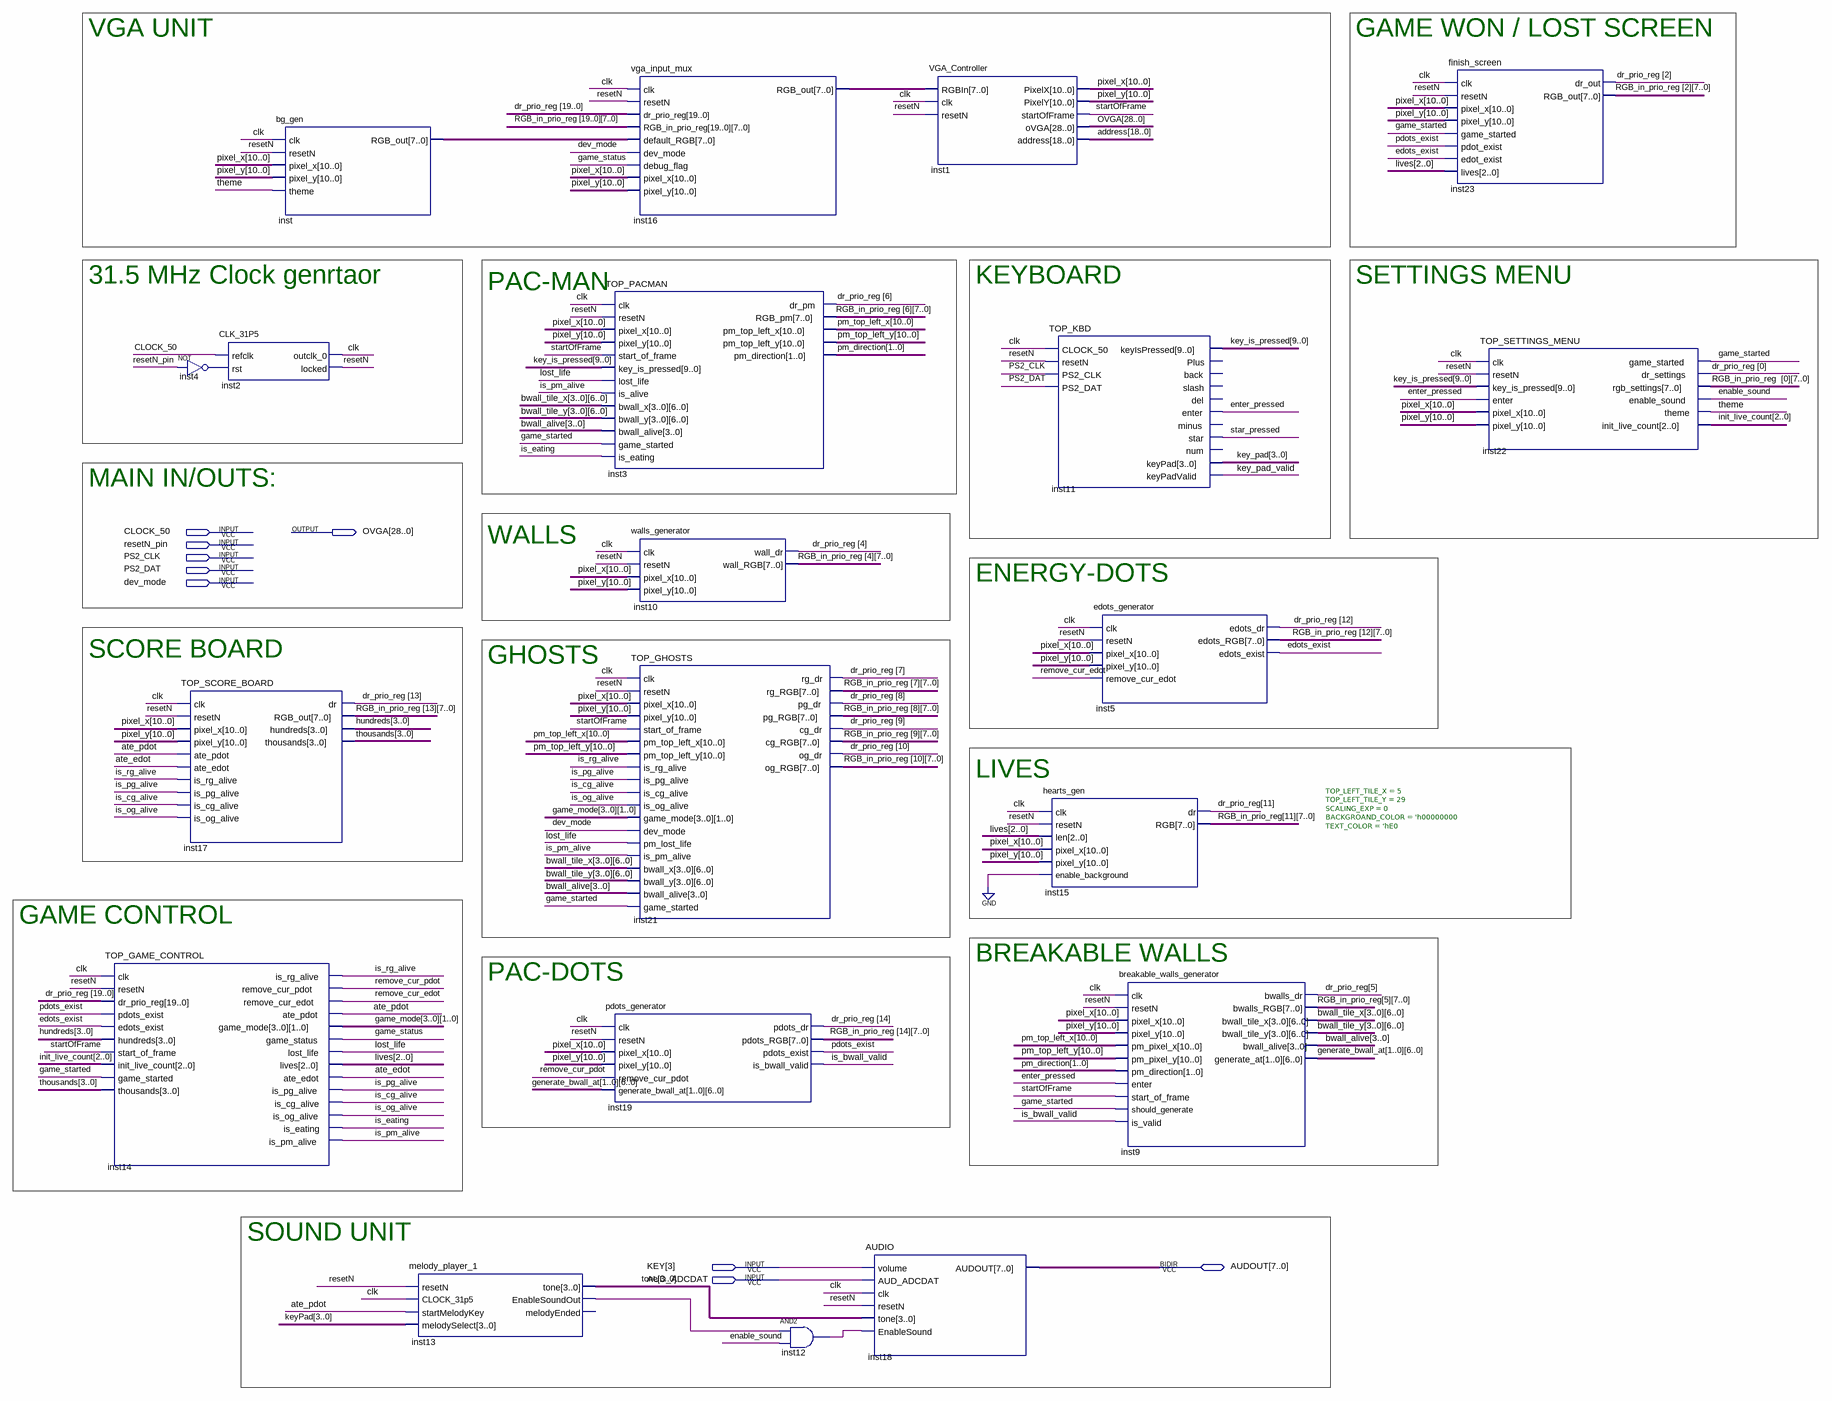
[diagram p0: schematic sheet]
// Quartus schematic TOP_GAME.bdf as structural Verilog: 20 symbols, 9 pins
module TOP_GAME (
  input  CLOCK_50,
  input  resetN_pin,
  input  PS2_CLK,
  input  PS2_DAT,
  input  dev_mode,
  input  [3:3] KEY,
  input  AUD_ADCDAT,
  inout  [7:0] AUDOUT,
  output [28:0] OVGA
);

  wire ate_edot, ate_pdot, clk, edots_exist, enable_sound, enter_pressed, game_started, game_status,
       inst4_out, inst12_out, inst13_enablesoundout, is_bwall_valid, is_cg_alive, is_eating, is_og_alive,
       is_pg_alive, is_pm_alive, is_rg_alive, key_pad_valid, lost_life, pdots_exist, remove_cur_edot,
       remove_cur_pdot, resetN, star_pressed, startOfFrame, theme;
  wire [1:0] game_mode_0, game_mode_1, game_mode_2, game_mode_3, pm_direction;
  wire [2:0] init_live_count, lives;
  wire [3:0] bwall_alive, hundreds, key_pad, keyPad, thousands, tone;
  wire [6:0] bwall_tile_x_0, bwall_tile_x_1, bwall_tile_x_2, bwall_tile_x_3, bwall_tile_y_0, bwall_tile_y_1,
       bwall_tile_y_2, bwall_tile_y_3, generate_bwall_at_0, generate_bwall_at_1;
  wire [7:0] inst16_rgb_out, inst_rgb_out, RGB_in_prio_reg_0, RGB_in_prio_reg_1, RGB_in_prio_reg_2,
       RGB_in_prio_reg_3, RGB_in_prio_reg_4, RGB_in_prio_reg_5, RGB_in_prio_reg_6, RGB_in_prio_reg_7,
       RGB_in_prio_reg_8, RGB_in_prio_reg_9, RGB_in_prio_reg_10, RGB_in_prio_reg_11, RGB_in_prio_reg_12,
       RGB_in_prio_reg_13, RGB_in_prio_reg_14, RGB_in_prio_reg_15, RGB_in_prio_reg_16, RGB_in_prio_reg_17,
       RGB_in_prio_reg_18, RGB_in_prio_reg_19;
  wire [9:0] key_is_pressed;
  wire [10:0] pixel_x, pixel_y, pm_top_left_x, pm_top_left_y;
  wire [18:0] address;
  wire [19:0] dr_prio_reg;

  TOP_GAME_CONTROL inst14 (
    .clk(clk), .resetN(resetN), .dr_prio_reg(dr_prio_reg), .pdots_exist(pdots_exist),
    .edots_exist(edots_exist), .hundreds(hundreds), .start_of_frame(startOfFrame),
    .init_live_count(init_live_count), .game_started(game_started), .thousands(thousands),
    .is_rg_alive(is_rg_alive), .remove_cur_pdot(remove_cur_pdot), .remove_cur_edot(remove_cur_edot),
    .ate_pdot(ate_pdot), .game_mode({game_mode_3, game_mode_2, game_mode_1, game_mode_0}),
    .game_status(game_status), .lost_life(lost_life), .lives(lives), .ate_edot(ate_edot),
    .is_pg_alive(is_pg_alive), .is_cg_alive(is_cg_alive), .is_og_alive(is_og_alive), .is_eating(is_eating),
    .is_pm_alive(is_pm_alive));
  not inst4 (inst4_out, resetN_pin);
  TOP_SCORE_BOARD inst17 (
    .clk(clk), .resetN(resetN), .pixel_x(pixel_x), .pixel_y(pixel_y), .ate_pdot(ate_pdot),
    .ate_edot(ate_edot), .is_rg_alive(is_rg_alive), .is_pg_alive(is_pg_alive), .is_cg_alive(is_cg_alive),
    .is_og_alive(is_og_alive), .dr(dr_prio_reg[13]), .RGB_out(RGB_in_prio_reg_13), .hundreds(hundreds),
    .thousands(thousands));
  CLK_31P5 inst2 (.refclk(CLOCK_50), .rst(inst4_out), .outclk_0(clk), .locked(resetN));
  bg_gen inst (.clk(clk), .resetN(resetN), .pixel_x(pixel_x), .pixel_y(pixel_y), .theme(theme), .RGB_out(inst_rgb_out));
  melody_player_1 inst13 (
    .resetN(resetN), .CLOCK_31p5(clk), .startMelodyKey(ate_pdot), .melodySelect(keyPad), .tone(tone),
    .EnableSoundOut(inst13_enablesoundout));  // open: melodyEnded
  vga_input_mux inst16 (
    .clk(clk), .resetN(resetN), .dr_prio_reg(dr_prio_reg),
    .RGB_in_prio_reg({RGB_in_prio_reg_19, RGB_in_prio_reg_18, RGB_in_prio_reg_17, RGB_in_prio_reg_16, RGB_in_prio_reg_15, RGB_in_prio_reg_14, RGB_in_prio_reg_13, RGB_in_prio_reg_12, RGB_in_prio_reg_11, RGB_in_prio_reg_10, RGB_in_prio_reg_9, RGB_in_prio_reg_8, RGB_in_prio_reg_7, RGB_in_prio_reg_6, RGB_in_prio_reg_5, RGB_in_prio_reg_4, RGB_in_prio_reg_3, RGB_in_prio_reg_2, RGB_in_prio_reg_1, RGB_in_prio_reg_0}),
    .default_RGB(inst_rgb_out), .dev_mode(dev_mode), .debug_flag(game_status), .pixel_x(pixel_x),
    .pixel_y(pixel_y), .RGB_out(inst16_rgb_out));
  TOP_PACMAN inst3 (
    .clk(clk), .resetN(resetN), .pixel_x(pixel_x), .pixel_y(pixel_y), .start_of_frame(startOfFrame),
    .key_is_pressed(key_is_pressed), .lost_life(lost_life), .is_alive(is_pm_alive),
    .bwall_x({bwall_tile_x_3, bwall_tile_x_2, bwall_tile_x_1, bwall_tile_x_0}),
    .bwall_y({bwall_tile_y_3, bwall_tile_y_2, bwall_tile_y_1, bwall_tile_y_0}), .bwall_alive(bwall_alive),
    .game_started(game_started), .is_eating(is_eating), .dr_pm(dr_prio_reg[6]), .RGB_pm(RGB_in_prio_reg_6),
    .pm_top_left_x(pm_top_left_x), .pm_top_left_y(pm_top_left_y), .pm_direction(pm_direction));
  walls_generator inst10 (
    .clk(clk), .resetN(resetN), .pixel_x(pixel_x), .pixel_y(pixel_y), .wall_dr(dr_prio_reg[4]),
    .wall_RGB(RGB_in_prio_reg_4));
  TOP_GHOSTS inst21 (
    .clk(clk), .resetN(resetN), .pixel_x(pixel_x), .pixel_y(pixel_y), .start_of_frame(startOfFrame),
    .pm_top_left_x(pm_top_left_x), .pm_top_left_y(pm_top_left_y), .is_rg_alive(is_rg_alive),
    .is_pg_alive(is_pg_alive), .is_cg_alive(is_cg_alive), .is_og_alive(is_og_alive),
    .game_mode({game_mode_3, game_mode_2, game_mode_1, game_mode_0}), .dev_mode(dev_mode),
    .pm_lost_life(lost_life), .is_pm_alive(is_pm_alive),
    .bwall_x({bwall_tile_x_3, bwall_tile_x_2, bwall_tile_x_1, bwall_tile_x_0}),
    .bwall_y({bwall_tile_y_3, bwall_tile_y_2, bwall_tile_y_1, bwall_tile_y_0}), .bwall_alive(bwall_alive),
    .game_started(game_started), .rg_dr(dr_prio_reg[7]), .rg_RGB(RGB_in_prio_reg_7), .pg_dr(dr_prio_reg[8]),
    .pg_RGB(RGB_in_prio_reg_8), .cg_dr(dr_prio_reg[9]), .cg_RGB(RGB_in_prio_reg_9), .og_dr(dr_prio_reg[10]),
    .og_RGB(RGB_in_prio_reg_10));
  pdots_generator inst19 (
    .clk(clk), .resetN(resetN), .pixel_x(pixel_x), .pixel_y(pixel_y), .remove_cur_pdot(remove_cur_pdot),
    .generate_bwall_at({generate_bwall_at_1, generate_bwall_at_0}), .pdots_dr(dr_prio_reg[14]),
    .pdots_RGB(RGB_in_prio_reg_14), .pdots_exist(pdots_exist), .is_bwall_valid(is_bwall_valid));
  and inst12 (inst12_out, inst13_enablesoundout, enable_sound);
  AUDIO inst18 (
    .volume(KEY[3]), .AUD_ADCDAT(AUD_ADCDAT), .clk(clk), .resetN(resetN), .tone(tone),
    .EnableSound(inst12_out), .AUDOUT(AUDOUT));
  VGA_Controller inst1 (
    .RGBIn(inst16_rgb_out), .clk(clk), .resetN(resetN), .PixelX(pixel_x), .PixelY(pixel_y),
    .startOfFrame(startOfFrame), .oVGA(OVGA), .address(address));
  TOP_KBD inst11 (
    .CLOCK_50(clk), .resetN(resetN), .PS2_CLK(PS2_CLK), .PS2_DAT(PS2_DAT), .keyIsPressed(key_is_pressed),
    .enter(enter_pressed), .star(star_pressed), .keyPad(key_pad), .keyPadValid(key_pad_valid));  // open: Plus, back, slash, del, minus, num
  hearts_gen #(.TOP_LEFT_TILE_X(5), .TOP_LEFT_TILE_Y(29), .SCALING_EXP(0), .BACKGROAND_COLOR('h00000000), .TEXT_COLOR('hE0)) inst15 (
    .clk(clk), .resetN(resetN), .len(lives), .pixel_x(pixel_x), .pixel_y(pixel_y), .enable_background(1'b0),
    .dr(dr_prio_reg[11]), .RGB(RGB_in_prio_reg_11));
  edots_generator inst5 (
    .clk(clk), .resetN(resetN), .pixel_x(pixel_x), .pixel_y(pixel_y), .remove_cur_edot(remove_cur_edot),
    .edots_dr(dr_prio_reg[12]), .edots_RGB(RGB_in_prio_reg_12), .edots_exist(edots_exist));
  breakable_walls_generator inst9 (
    .clk(clk), .resetN(resetN), .pixel_x(pixel_x), .pixel_y(pixel_y), .pm_pixel_x(pm_top_left_x),
    .pm_pixel_y(pm_top_left_y), .pm_direction(pm_direction), .enter(enter_pressed),
    .start_of_frame(startOfFrame), .should_generate(game_started), .is_valid(is_bwall_valid),
    .bwalls_dr(dr_prio_reg[5]), .bwalls_RGB(RGB_in_prio_reg_5),
    .bwall_tile_x({bwall_tile_x_3, bwall_tile_x_2, bwall_tile_x_1, bwall_tile_x_0}),
    .bwall_tile_y({bwall_tile_y_3, bwall_tile_y_2, bwall_tile_y_1, bwall_tile_y_0}),
    .bwall_alive(bwall_alive), .generate_at({generate_bwall_at_1, generate_bwall_at_0}));
  finish_screen inst23 (
    .clk(clk), .resetN(resetN), .pixel_x(pixel_x), .pixel_y(pixel_y), .game_started(game_started),
    .pdot_exist(pdots_exist), .edot_exist(edots_exist), .lives(lives), .dr_out(dr_prio_reg[2]),
    .RGB_out(RGB_in_prio_reg_2));
  TOP_SETTINGS_MENU inst22 (
    .clk(clk), .resetN(resetN), .key_is_pressed(key_is_pressed), .enter(enter_pressed), .pixel_x(pixel_x),
    .pixel_y(pixel_y), .game_started(game_started), .dr_settings(dr_prio_reg[0]),
    .rgb_settings(RGB_in_prio_reg_0), .enable_sound(enable_sound), .theme(theme),
    .init_live_count(init_live_count));

  // Notes on the sheet:
  //   VGA UNIT
  //   GAME WON / LOST SCREEN
  //   31.5 MHz Clock genrtaor
  //   KEYBOARD
  //   SETTINGS MENU
  //   PAC-MAN
  //   MAIN IN/OUTS:
  //   WALLS
  //   ENERGY-DOTS
  //   SCORE BOARD
  //   GHOSTS
  //   LIVES
  //   GAME CONTROL
  //   BREAKABLE WALLS
  //   PAC-DOTS
  //   SOUND UNIT
endmodule
